# Altium project PS__INN3947CQ.PrjPCB
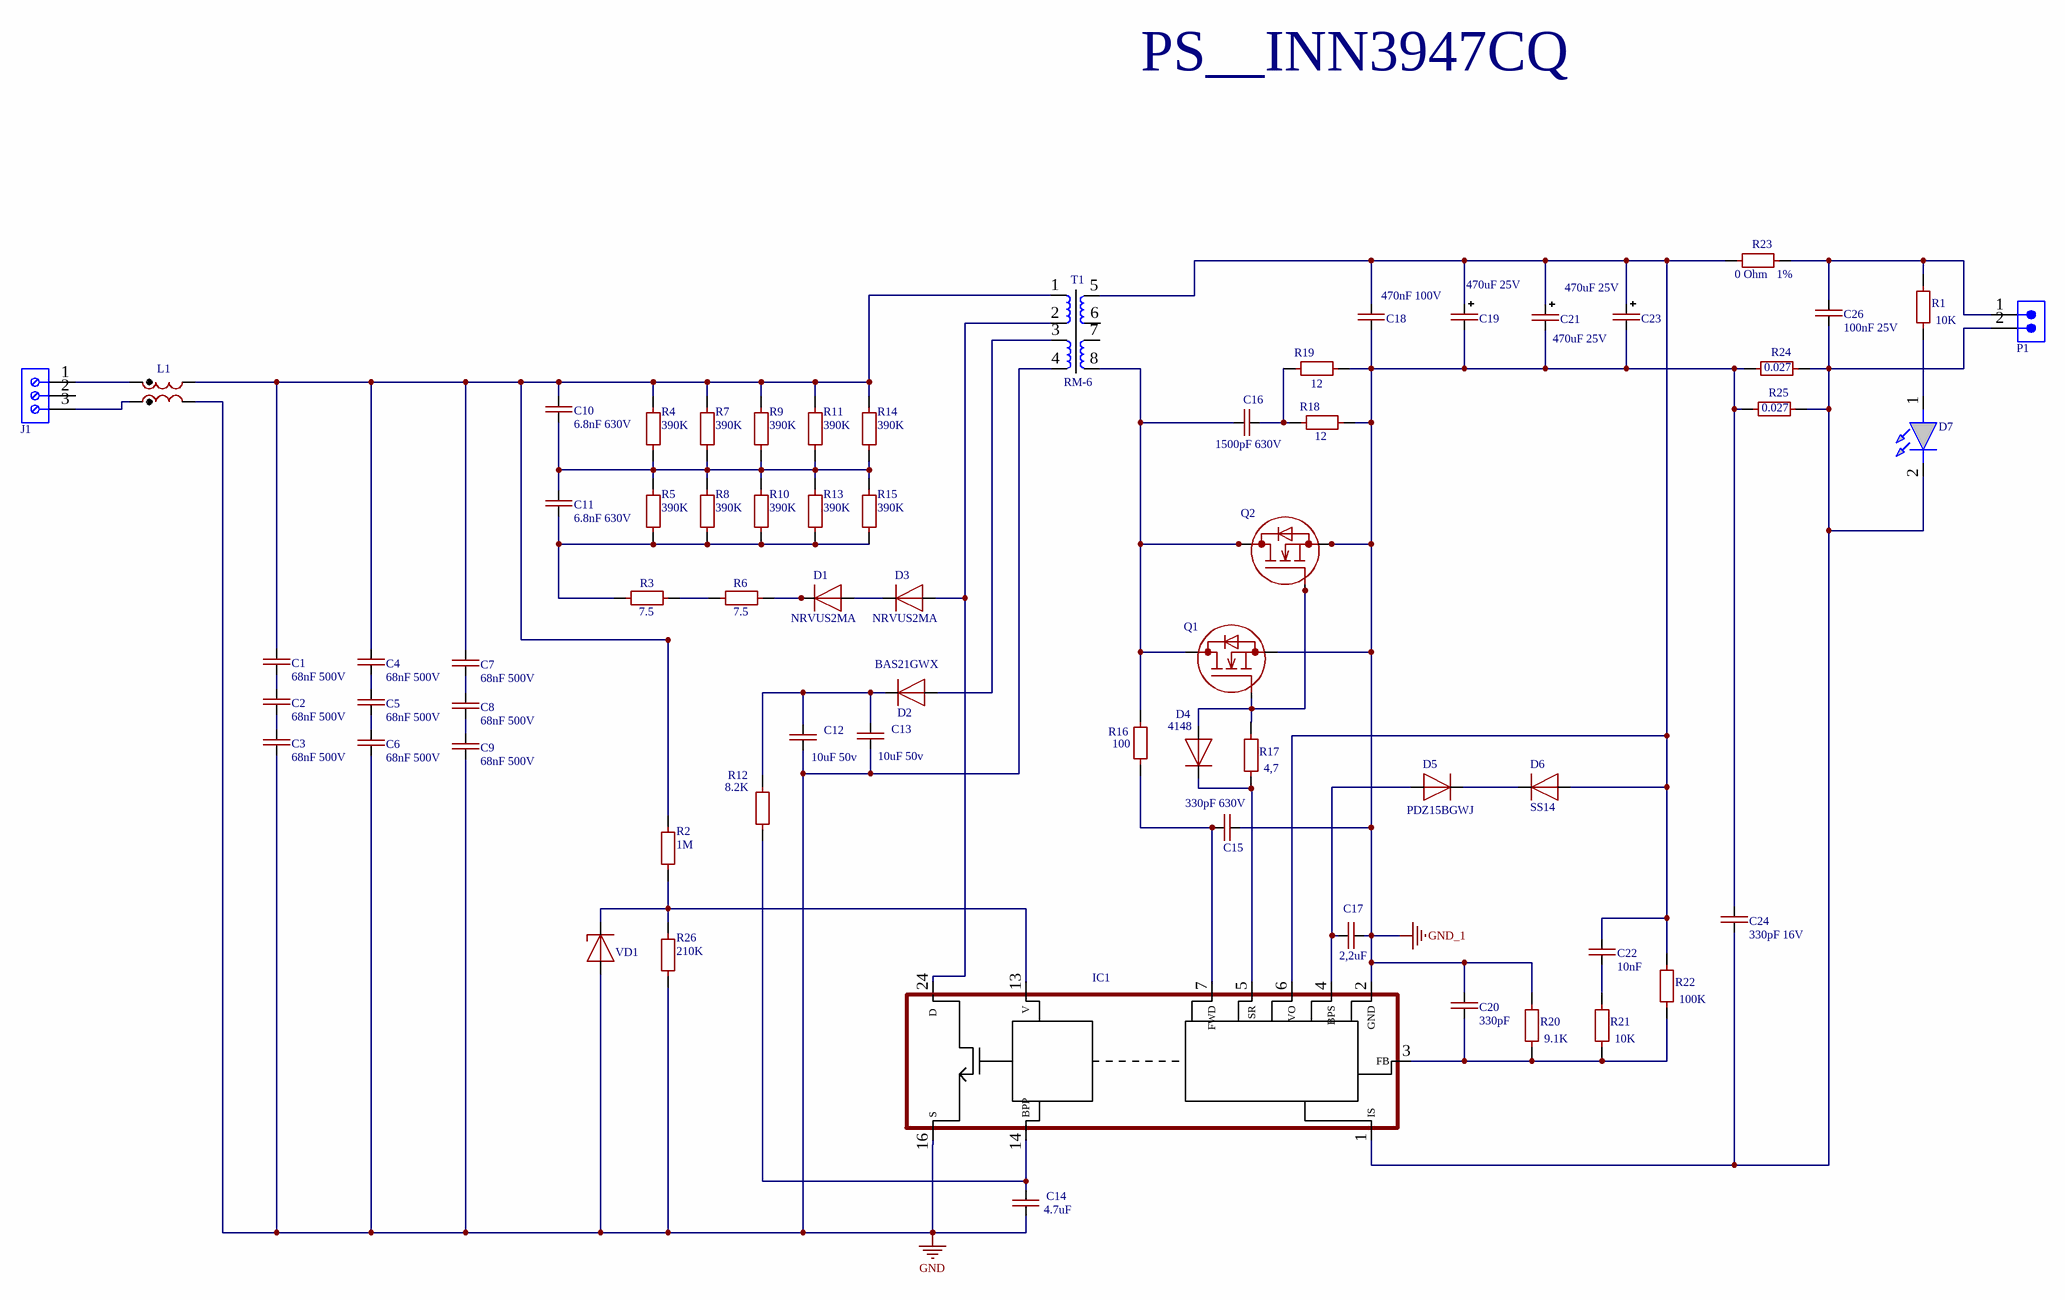
[diagram p0: PS__INN3947CQ.SchDoc]
1 sheet, 66 parts. Net scope: global (net labels, ports and power ports of the same name join across sheets).
Board file: PS__INN3947CQ.PcbDoc

## Sheet PS__INN3947CQ.SchDoc
size A2; SPICEModelCacheYQEDCYZF: <root> / <DocumentId>YQEDCYZF</DocumentId> / </root>

### Parts
C1  68nF 500V  [CAP-1206]
C2  68nF 500V  [CAP-1206]
C3  68nF 500V  [CAP-1206]
C4  68nF 500V  [CAP-1206]
C5  68nF 500V  [CAP-1206]
C6  68nF 500V  [CAP-1206]
C7  68nF 500V  [CAP-1206]
C8  68nF 500V  [CAP-1206]
C9  68nF 500V  [CAP-1206]
C10  6.8nF 630V  [CAP-1206]
C11  6.8nF 630V  [CAP-1206]
C12  10uF 50v  [CAP-0805]
C13  10uF 50v  [CAP-0805]
C14  4.7uF  [CAP-0805]
C15  330pF 630V  [CAP-1206]
C16  1500pF 630V  [CAP-1206]
C17  2,2uF  [CAP-1206]
C18  470nF 100V  [CAP-1206]
C19  470uF 25V  [CAPPOL_SMD_SIZE_E]
C20  330pF  [CAP-0805]
C21  470uF 25V  [CAPPOL_SMD_SIZE_E]
C22  10nF  [CAP-0805]
C23  470uF 25V  [CAPPOL_SMD_SIZE_E]
C24  330pF 16V  [CAP-0805]
C26  100nF 25V  [CAP-0805]
D1  NRVUS2MA  [DO-214AC, SMA]
D2  BAS21GWX  [SOD-123]
D3  NRVUS2MA  [DO-214AC, SMA]
D4  4148  [SOD-123]
D5  PDZ15BGWJ  [SOD-123]
D6  SS14  [DO-214AC, SMA]
D7  151031YS06000  [LED_BLUE]  (value not drawn)
IC1  INN3947CQ  [INN3947CQ]  (value not drawn)
J1  691101710003  [691101710003]  (value not drawn)
L1  L_13x13mm  [L_13x13mm]  (value not drawn)
P1  691701530002B  [691701530002B]  (value not drawn)
Q1  DMT15H017LPS  [DMT15H017LPS_SWP]  (value not drawn)
Q2  DMT15H017LPS  [DMT15H017LPS_SWP]  (value not drawn)
R1  10K  [RES-0805]
R2  1M  [RES-0805]
R3  7.5  [RES-1206]
R4  390K  [RES-1206]
R5  390K  [RES-1206]
R6  7.5  [RES-1206]
R7  390K  [RES-1206]
R8  390K  [RES-1206]
R9  390K  [RES-1206]
R10  390K  [RES-1206]
R11  390K  [RES-1206]
R12  8.2K  [RES-0805]
R13  390K  [RES-1206]
R14  390K  [RES-1206]
R15  390K  [RES-1206]
R16  100  [RES-0805]
R17  4,7  [RES-0805]
R18  12  [RES-0805]
R19  12  [RES-0805]
R20  9.1K  [RES-0805]
R21  10K  [RES-0805]
R22  100K  [RES-0805]
R23  0 Ohm   1%  [RES-1206]
R24  0.027  [RES-0805]
R25  0.027  [RES-0805]
R26  210K  [RES-0805]
T1  RM-6  [TRANS_RM6]
VD1  ZENER  [SOD-80]  (value not drawn)

### Nets
GND: C3.2 C6.2 C9.2 C12.1 C13.1 C14.1 IC1.16(S) L1.4 R26.2 T1.4 VD1.2(A)
GND_1: C15.2 C17.2 C18.1 C19.2(-) C20.2 C21.2(-) C23.2(-) C24.2 IC1.2(GND) Q1.3(S) Q2.3(S) R18.1 R19.1 R20.2 R24.2 R25.2
NetC1_1: C1.1 C4.1 C7.1 C10.1 L1.2 R2.1 R4.1 R7.1 R9.1 R11.1 R14.1 T1.1
NetC1_2: C1.2 C2.1
NetC2_2: C2.2 C3.1
NetC4_2: C4.2 C5.1
NetC5_2: C5.2 C6.1
NetC7_2: C7.2 C8.1
NetC8_2: C8.2 C9.1
NetC10_2: C10.2 C11.1 R4.2 R5.1 R7.2 R8.1 R9.2 R10.1 R11.2 R13.1 R14.2 R15.1
NetC11_2: C11.2 R3.2 R5.2 R8.2 R10.2 R13.2 R15.2
NetC12_2: C12.2 C13.2 D2.1(C) R12.2
NetC14_2: C14.2 IC1.14(BPP) R12.1
NetC15_1: C15.1 IC1.7(FWD) R16.1
NetC16_1: C16.1 R18.2 R19.2
NetC16_2: C16.2 Q1.2(D) Q2.2(D) R16.2 T1.8
NetC17_1: C17.1 D5.2(A) IC1.4(BPS)
NetC18_2: C18.2 C19.1(+) C21.1(+) C22.2 C23.1(+) D6.2(A) IC1.6(VO) R22.2 R23.2 T1.5
NetC20_1: C20.1 IC1.3(FB) R20.1 R21.1 R22.1
NetC22_1: C22.1 R21.2
NetC24_1: C24.1 C26.2 D7.2(K) IC1.1(IS) P1.2 R24.1 R25.1
NetC26_1: C26.1 P1.1 R1.2 R23.1
NetD1_1: D1.1(C) R6.1
NetD1_2: D1.2(A) D3.1(C)
NetD2_2: D2.2(A) T1.3
NetD3_2: D3.2(A) IC1.24(D) T1.2
NetD4_1: D4.1(C) IC1.5(SR) R17.1
NetD4_2: D4.2(A) Q1.1(G) Q2.1(G) R17.2
NetD5_1: D5.1(C) D6.1(C)
NetD7_1: D7.1(A) R1.1
NetIC1_13: IC1.13(V) R2.2 R26.1 VD1.1(C)
NetJ1_1: J1.1 L1.1
NetJ1_3: J1.3 L1.3
NetR3_1: R3.1 R6.2

Not connected (* = marked no-connect by the designer): J1 2; T1 6 7

### Notes on the sheet
- PS__INN3947CQ

### Library data of the parts
C1-C18 C20 C22 C24 C26 = CAP-NON-POLAR
C19 C21 C23 = CAP-POLAR
D1-D6 = DIODE
D7 = LED: WURTH ELEKTRONIK - 151031YS06000 - LED, Yellow, Through Hole, T-1 (3mm), 30 mA, 2 V, 590 nm; Geometry.Height: 5.5mm; Manufacturer_Name: Wurth Elektronik; Manufacturer_Part_Number: 151031YS06000; Mouser Part Number: 710-151031YS06000; Mouser Price/Stock: https://www.mouser.co.uk/ProductDetail/Wurth-Elektronik/151031YS06000?qs=LlUlMxKIyB3xSYYW%252BcuBiQ%3D%3D; Arrow Part Number: *; Arrow Price/Stock: *; Mouser Testing Part Number: *; Mouser Testing Price/Stock: *; Datasheet Link: https://katalog.we-online.de/led/datasheet/151031YS06000.pdf
J1 = 691101710003: WR-TBL Series 101 Horizontal Entry Modular, THT, pitch 5mm, 3p; Manufacturer: Wurth Elektronik; Modularity: Yes; Rated Current: 16A; Working Voltage: 250V; ComponentLink1Description: Website Link; ComponentLink1URL: https://www.we-online.com/redexpert/article/691101710003?ad; ComponentLink2Description: Datasheet Link; ComponentLink2URL: https://www.we-online.com/redexpert/spec/691101710003?ad; Manufacturer Part Number: 691101710003; Category: Terminal Blocks; Match Code: WR-TBL; Mount: Through Hole; Operating Temperature Max: 105°C; Operating Temperature Min: -40°C; Packaging: Box; Application: Pressure Clamp; Number of Pins: 3; Number of Rows: 1; Orientation: Horizontal; Pitch: 5mm
P1 = 691701530002B: WR-TBL Series 7015B Open Horizontal PCB Header, SMT, pitch 5.08mm, 2p; Manufacturer: Wurth Elektronik; Modularity: No; Rated Current: 10A; Working Voltage: 300V; ComponentLink1Description: Website Link; ComponentLink1URL: https://www.we-online.com/redexpert/article/691701530002B?ad; ComponentLink2Description: Datasheet Link; ComponentLink2URL: https://www.we-online.com/redexpert/spec/691701530002B?ad; Manufacturer Part Number: 691701530002B; Category: Terminal Blocks; Match Code: WR-TBL; Mount: Surface Mount; Operating Temperature Max: 105°C; Operating Temperature Min: -40°C; Packaging: Box; Application: Pluggable; Number of Pins: 2; Number of Rows: 1; Orientation: Horizontal; Pitch: 5.08mm
R1-R26 = RES-CONST
T1 = RM_6_12-12-18-18